# EAGLE schematic main (EAGLE 6.2)
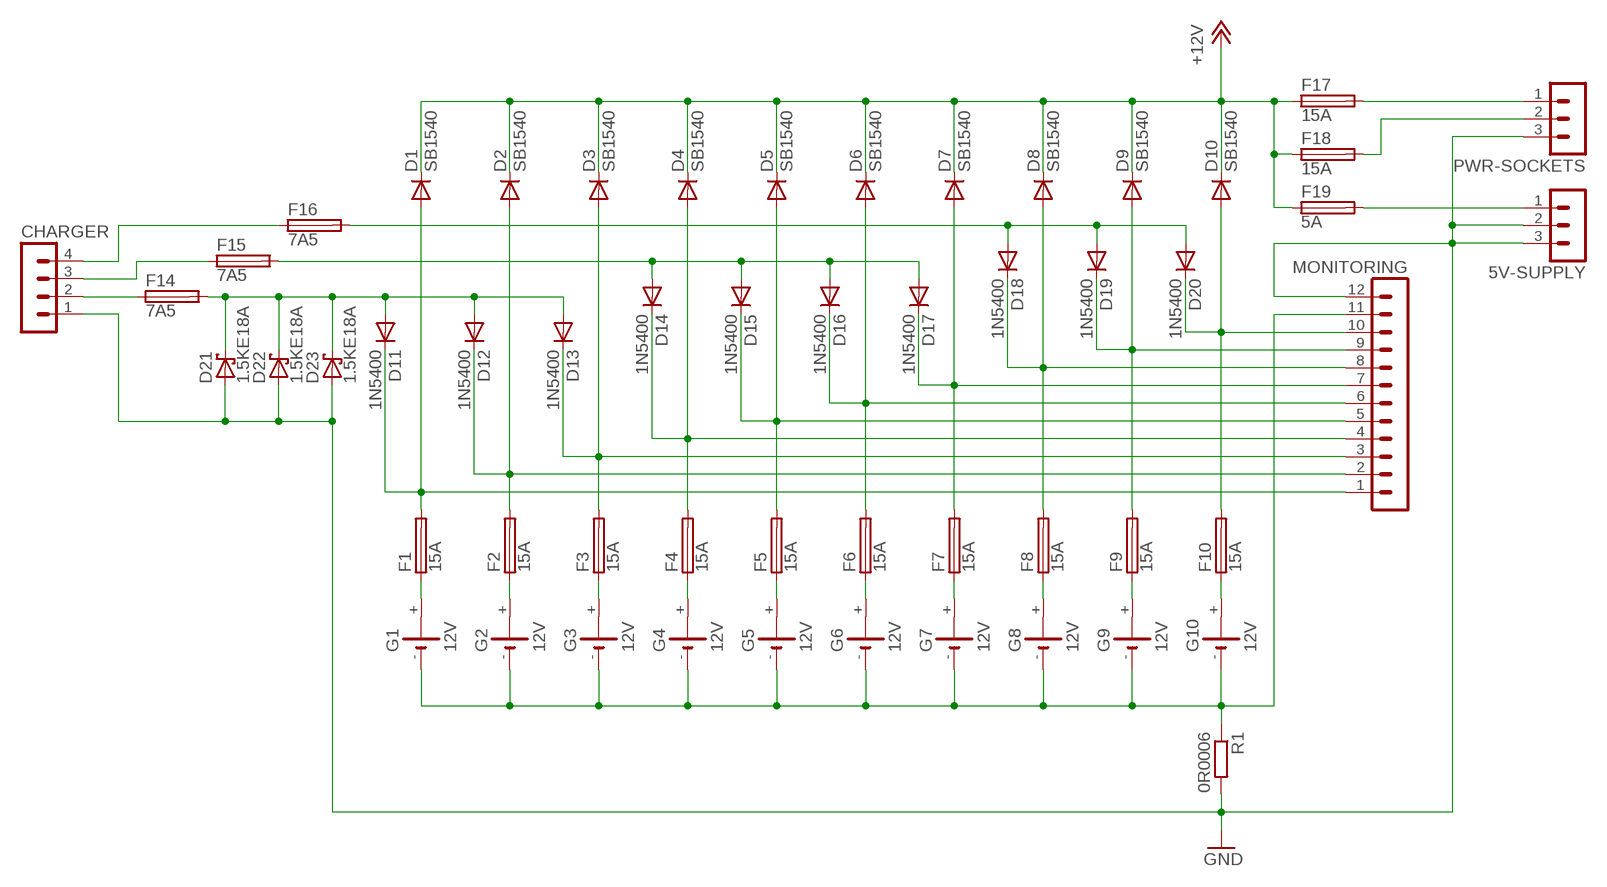
[diagram p0: schematic, sheet 1]

## Parts
5V-SUPPLY  MA03-1  [MA03-1]
CHARGER  MA04-1  [MA04-1]
D1  SB1540  SB120  [DO41-10]
D2  SB1540  SB120  [DO41-10]
D3  SB1540  SB120  [DO41-10]
D4  SB1540  SB120  [DO41-10]
D5  SB1540  SB120  [DO41-10]
D6  SB1540  SB120  [DO41-10]
D7  SB1540  SB120  [DO41-10]
D8  SB1540  SB120  [DO41-10]
D9  SB1540  SB120  [DO41-10]
D10  SB1540  SB120  [DO41-10]
D11  1N5400  [DO201-15]
D12  1N5400  [DO201-15]
D13  1N5400  [DO201-15]
D14  1N5400  [DO201-15]
D15  1N5400  [DO201-15]
D16  1N5400  [DO201-15]
D17  1N5400  [DO201-15]
D18  1N5400  [DO201-15]
D19  1N5400  [DO201-15]
D20  1N5400  [DO201-15]
D21  1.5KE18A  P6KEXXA  [C1702-15]
D22  1.5KE18A  P6KEXXA  [C1702-15]
D23  1.5KE18A  P6KEXXA  [C1702-15]
F1  15A  SH22  [SH22]
F2  15A  SH22  [SH22]
F3  15A  SH22  [SH22]
F4  15A  SH22  [SH22]
F5  15A  SH22  [SH22]
F6  15A  SH22  [SH22]
F7  15A  SH22  [SH22]
F8  15A  SH22  [SH22]
F9  15A  SH22  [SH22]
F10  15A  SH22  [SH22]
F14  7A5  SH22  [SH22]
F15  7A5  SH22  [SH22]
F16  7A5  SH22  [SH22]
F17  15A  SH22  [SH22]
F18  15A  SH22  [SH22]
F19  5A  SH22  [SH22]
G1  12V  1V60R  [1V60R]
G2  12V  1V60R  [1V60R]
G3  12V  1V60R  [1V60R]
G4  12V  1V60R  [1V60R]
G5  12V  1V60R  [1V60R]
G6  12V  1V60R  [1V60R]
G7  12V  1V60R  [1V60R]
G8  12V  1V60R  [1V60R]
G9  12V  1V60R  [1V60R]
G10  12V  1V60R  [1V60R]
MONITORING  MA12-1  [MA12-1]
PWR-SOCKETS  MA03-1  [MA03-1]
R1  0R0006  R-EU_0204/2V  [0204V]

## Nets
+12V: D1.C D2.C D3.C D4.C D5.C D6.C D7.C D8.C D9.C D10.C F17.1 F18.1 F19.1
GND: 5V-SUPPLY.2 5V-SUPPLY.3 CHARGER.1 D21.A D22.A D23.A MONITORING.12 PWR-SOCKETS.3 R1.2
N$1: G1.- G2.- G3.- G4.- G5.- G6.- G7.- G8.- G9.- G10.- MONITORING.11 R1.1
N$2: F1.1 G1.+
N$3: F2.1 G2.+
N$4: F3.1 G3.+
N$5: F4.1 G4.+
N$6: F5.1 G5.+
N$7: F6.1 G6.+
N$8: F7.1 G7.+
N$9: F8.1 G8.+
N$10: F9.1 G9.+
N$11: F10.1 G10.+
N$12: D1.A D11.C F1.2 MONITORING.1
N$13: D2.A D12.C F2.2 MONITORING.2
N$14: D3.A D13.C F3.2 MONITORING.3
N$15: D4.A D14.C F4.2 MONITORING.4
N$16: D5.A D15.C F5.2 MONITORING.5
N$17: D6.A D16.C F6.2 MONITORING.6
N$18: D7.A D17.C F7.2 MONITORING.7
N$19: D8.A D18.C F8.2 MONITORING.8
N$20: D9.A D19.C F9.2 MONITORING.9
N$21: D10.A D20.C F10.2 MONITORING.10
N$22: CHARGER.2 F14.1
N$23: D11.A D12.A D13.A D21.C D22.C D23.C F14.2
N$25: D18.A D19.A D20.A F16.2
N$26: CHARGER.3 F15.1
N$27: CHARGER.4 F16.1
N$28: F17.2 PWR-SOCKETS.1
N$29: F18.2 PWR-SOCKETS.2
N$30: 5V-SUPPLY.1 F19.2
N$31: D14.A D15.A D16.A D17.A F15.2
Unconnected: G1.+@1(+) G2.+@1(+) G3.+@1(+) G4.+@1(+) G5.+@1(+) G6.+@1(+) G7.+@1(+) G8.+@1(+) G9.+@1(+) G10.+@1(+)

## Library data of the parts
5V-SUPPLY PWR-SOCKETS = con-lstb:MA03-1: PIN HEADER; OC_FARNELL: unknown; OC_NEWARK: unknown
CHARGER = con-lstb:MA04-1: PIN HEADER; OC_FARNELL: unknown; OC_NEWARK: unknown
D1-D10 = diode:SB120: DIODE barrier rectifier, 1 A (Fairchild)
D11-D20 = diode:1N5400: DIODE standard rectifier, 3 A, 50 V (Motorola)
D21-D23 = diode:P6KEXXA: DIODE transient-voltage suppressor
F1-F10 F14-F19 = fuse:SH22: FUSE HOLDER CS PFP30, Schukat; OC_FARNELL: unknown; OC_NEWARK: unknown
G1-G10 = battery:1V60R: NC ACCU Varta
MONITORING = con-lstb:MA12-1: PIN HEADER; OC_FARNELL: unknown; OC_NEWARK: unknown
R1 = rcl:R-EU_: RESISTOR, European symbol